# Altium schematic sheet Programming_Interface.SchDoc: Наименование
size 420 x 297 mm; ApprovedBy: Сидоров; CheckedBy: Петров; Author: Иванов; CompanyName: РГППУ; Title2str: Изделия; DecimalNumber: АБВГ.123456.001 33
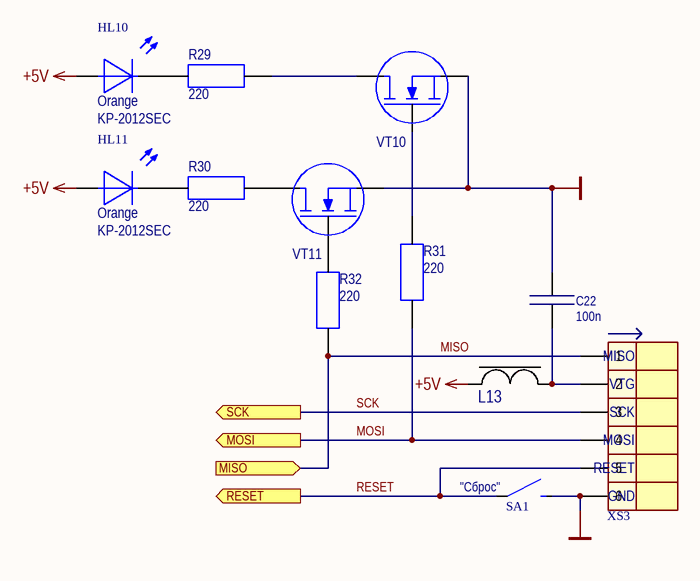
[diagram p0: Programming_Interface.SchDoc]

## Parts
C22  100n  [SMDRC0805]
HL10  Orange  ManufacturerPartNumber: KP-2012SEC  [DIOMELF2012M]
HL11  Orange  ManufacturerPartNumber: KP-2012SEC  [DIOMELF2012M]
L13  MPZ1608S181A  [INDC0603X03M]  (value not drawn)
R29  220  [SMDRC0805]
R30  220  [SMDRC0805]
R31  220  [SMDRC0805]
R32  220  [SMDRC0805]
SA1  DTSM20-4.3  [DTSM20]  (value not drawn)
VT10  2N7002  [SOT23 (TO-236AB)]  (value not drawn)
VT11  2N7002  [SOT23 (TO-236AB)]  (value not drawn)
XS3  IDC-06M  [IDC-06M]  (value not drawn)

## Ports
MISO (in), MOSI (out), RESET (out), SCK (out)

## Nets
+5V: HL10.1 HL11.1 L13.1
GND: C22.2 SA1.2 VT10.2(S) VT11.2(S) XS3.6
MISO: R32.1 XS3.1 ; port MISO
MOSI: R31.1 XS3.4 ; port MOSI
RESET: SA1.1 XS3.5 ; port RESET
SCK: XS3.3 ; port SCK
NetC22_1: C22.1 L13.2 XS3.2
NetHL10_2: HL10.2 R29.2
NetHL11_2: HL11.2 R30.2
NetR29_1: R29.1 VT10.3(D)
NetR30_1: R30.1 VT11.3(D)
NetR31_2: R31.2 VT10.1(G)
NetR32_2: R32.2 VT11.1(G)

## Notes on the sheet
- (near SA1) "Сброс"
- Изм.
- Лист
- N*докум.
- Подп.
- Дата
- Лит.
- Масса
- Масштаб
- Разраб.
- Пров.
- Т.контр.
- Лиcт
- Лиcтов
- Н.контр.
- Утв.
- (in symbol Con6_M IDC-06M_SPI) MISO; VTG; SCK; MOSI; RESET; GND

## Library data of the parts
C22 = Capacitor 0805 100n: Generic capasitor non-polar; PartNumber: Capacitor 0805 100n; Value: 100n; ComponentLink1Description: Datasheet; Package: 0805
HL10 HL11 = LED1_O: Diod LED SMD Orange; ComponentLink1Description: Datasheet; Cost: 4,91; ComponentLink2Description: Datasheet-local; ComponentLink2URL: *; Color: Orange
L13 = Ferrite Bead: Value: ? мГн; ManufacturerPartNumber: MPZ1608S181A; ComponentLink1Description: Datasheet; Supplier: Промэлектроника; ComponentLink2Description: Datasheet-local; ComponentLink2URL: *
R29-R32 = Resistor 0805 220: Generic resistor; PartNumber: Resistor 0805 220; Value: 220; ComponentLink1URL: http://www.mouser.com/ds/2/447/PYu-RC0402_51_RoHS_L_6_r-8721.pdf; ComponentLink1Description: Datasheet; Package: 0805
SA1 = Switch1_DTSM20-4.3: Switch open; Manufacturer: Diptronics; ManufacturerPartNumber: DTSM20-4.3; ComponentLink1Description: Datasheet; ComponentLink1URL: http://www.promelec.ru/catalog/407/1291/1323/1/70721/; ComponentLink2Description: Datasheet-local; ComponentLink2URL: *
VT10 VT11 = 2N7002 n-MOSFET: 60V, 300mA N-channel Trench MOSFET; ManufacturerPartNumber: 2N7002
XS3 = Con6_M IDC-06M_SPI: SPI connector; ManufacturerPartNumber: IDC-06M; ComponentLink1Description: Datasheet; ComponentLink1URL: http://www.promelec.ru/catalog/406/1218/1223/1/156430/; ComponentLink2Description: Datasheet-local; ComponentLink2URL: *